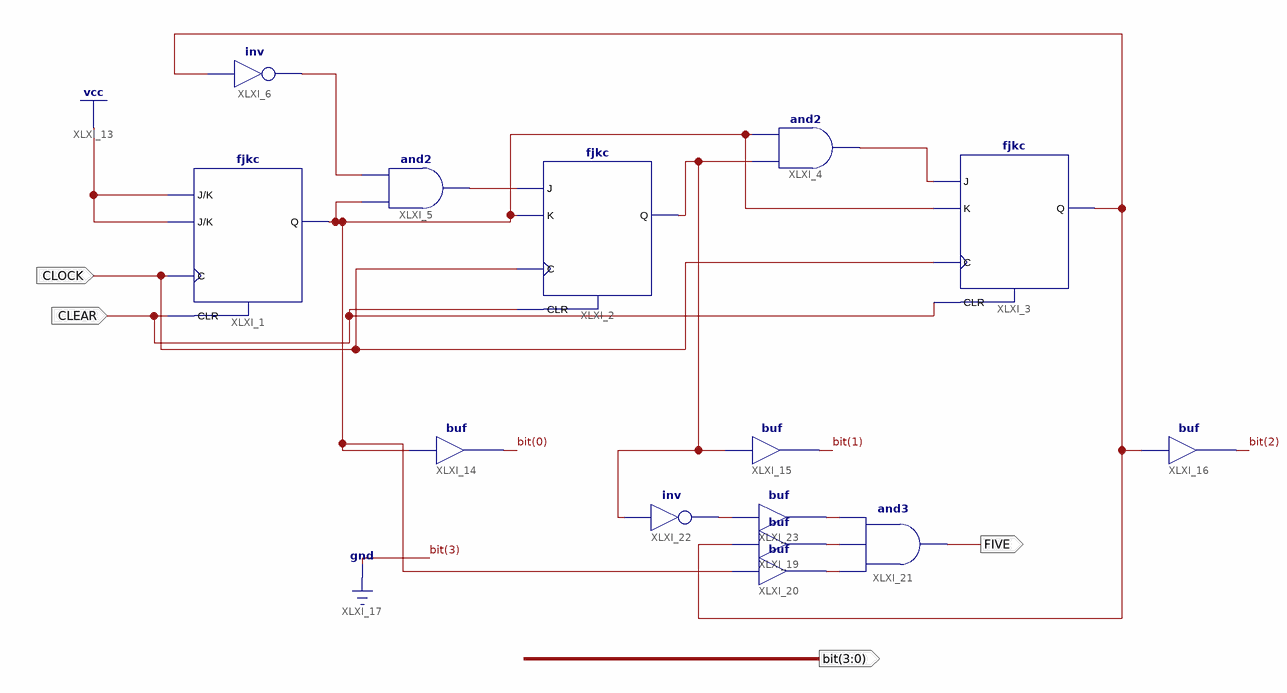
[diagram p0: schematic sheet 1]
// Xilinx ISE schematic counter05.sch (spartan6) as structural Verilog: 14 symbols, 4 ports
module counter05 (
  input  CLOCK,
  input  CLEAR,
  output [3:0] \bit ,
  output FIVE
);

  wire XLXN_3, XLXN_12, XLXN_13, XLXN_15, XLXN_30, XLXN_31, XLXN_38, XLXN_39, XLXN_55, XLXN_57;

  fjkc XLXI_3 (.C(CLOCK), .CLR(CLEAR), .J(XLXN_3), .K(XLXN_30), .Q(XLXN_12));
  fjkc XLXI_2 (.C(CLOCK), .CLR(CLEAR), .J(XLXN_15), .K(XLXN_30), .Q(XLXN_31));
  and XLXI_4 (XLXN_3, XLXN_31, XLXN_30);
  fjkc XLXI_1 (.C(CLOCK), .CLR(CLEAR), .J(1'b1), .K(1'b1), .Q(XLXN_30));
  and XLXI_5 (XLXN_15, XLXN_30, XLXN_13);
  not XLXI_6 (XLXN_13, XLXN_12);
  buf XLXI_14 (\bit [0], XLXN_30);
  buf XLXI_15 (\bit [1], XLXN_31);
  buf XLXI_16 (\bit [2], XLXN_12);
  buf XLXI_20 (XLXN_39, XLXN_30);
  buf XLXI_19 (XLXN_38, XLXN_12);
  and XLXI_21 (FIVE, XLXN_39, XLXN_38, XLXN_55);
  not XLXI_22 (XLXN_57, XLXN_31);
  buf XLXI_23 (XLXN_55, XLXN_57);

  assign \bit [3] = 1'b0;
endmodule
